# Altium schematic sheet Sheet1.SchDoc
size 420 x 297 mm; CheckedBy: Антошкин; Author: Жигалов; CompanyName: RK3AZB; DrawnBy: -; Engineer: -; DocumentNumber: -; PageSetup: Record=PageOptions|CenterHorizontal=True|CenterVertical=True|PrintScale=0.94|XCorrection=1.00|YCorrection=1.00|PrintKind=1|BorderSize=5000000|LeftOffset=0|BottomOffset=0|Orientation=1|PaperLength=1000|PaperWidth=1000|Scale=100|PaperSource=7|PrintQuality=-4|MediaType=1|DitherType=10|PaperKind=A4|PrintScaleMode=1; DecimalNumber: ---; HeadOfSector: -; MainDevice: ---; Name: Приемник Полякова; ImagePath: -
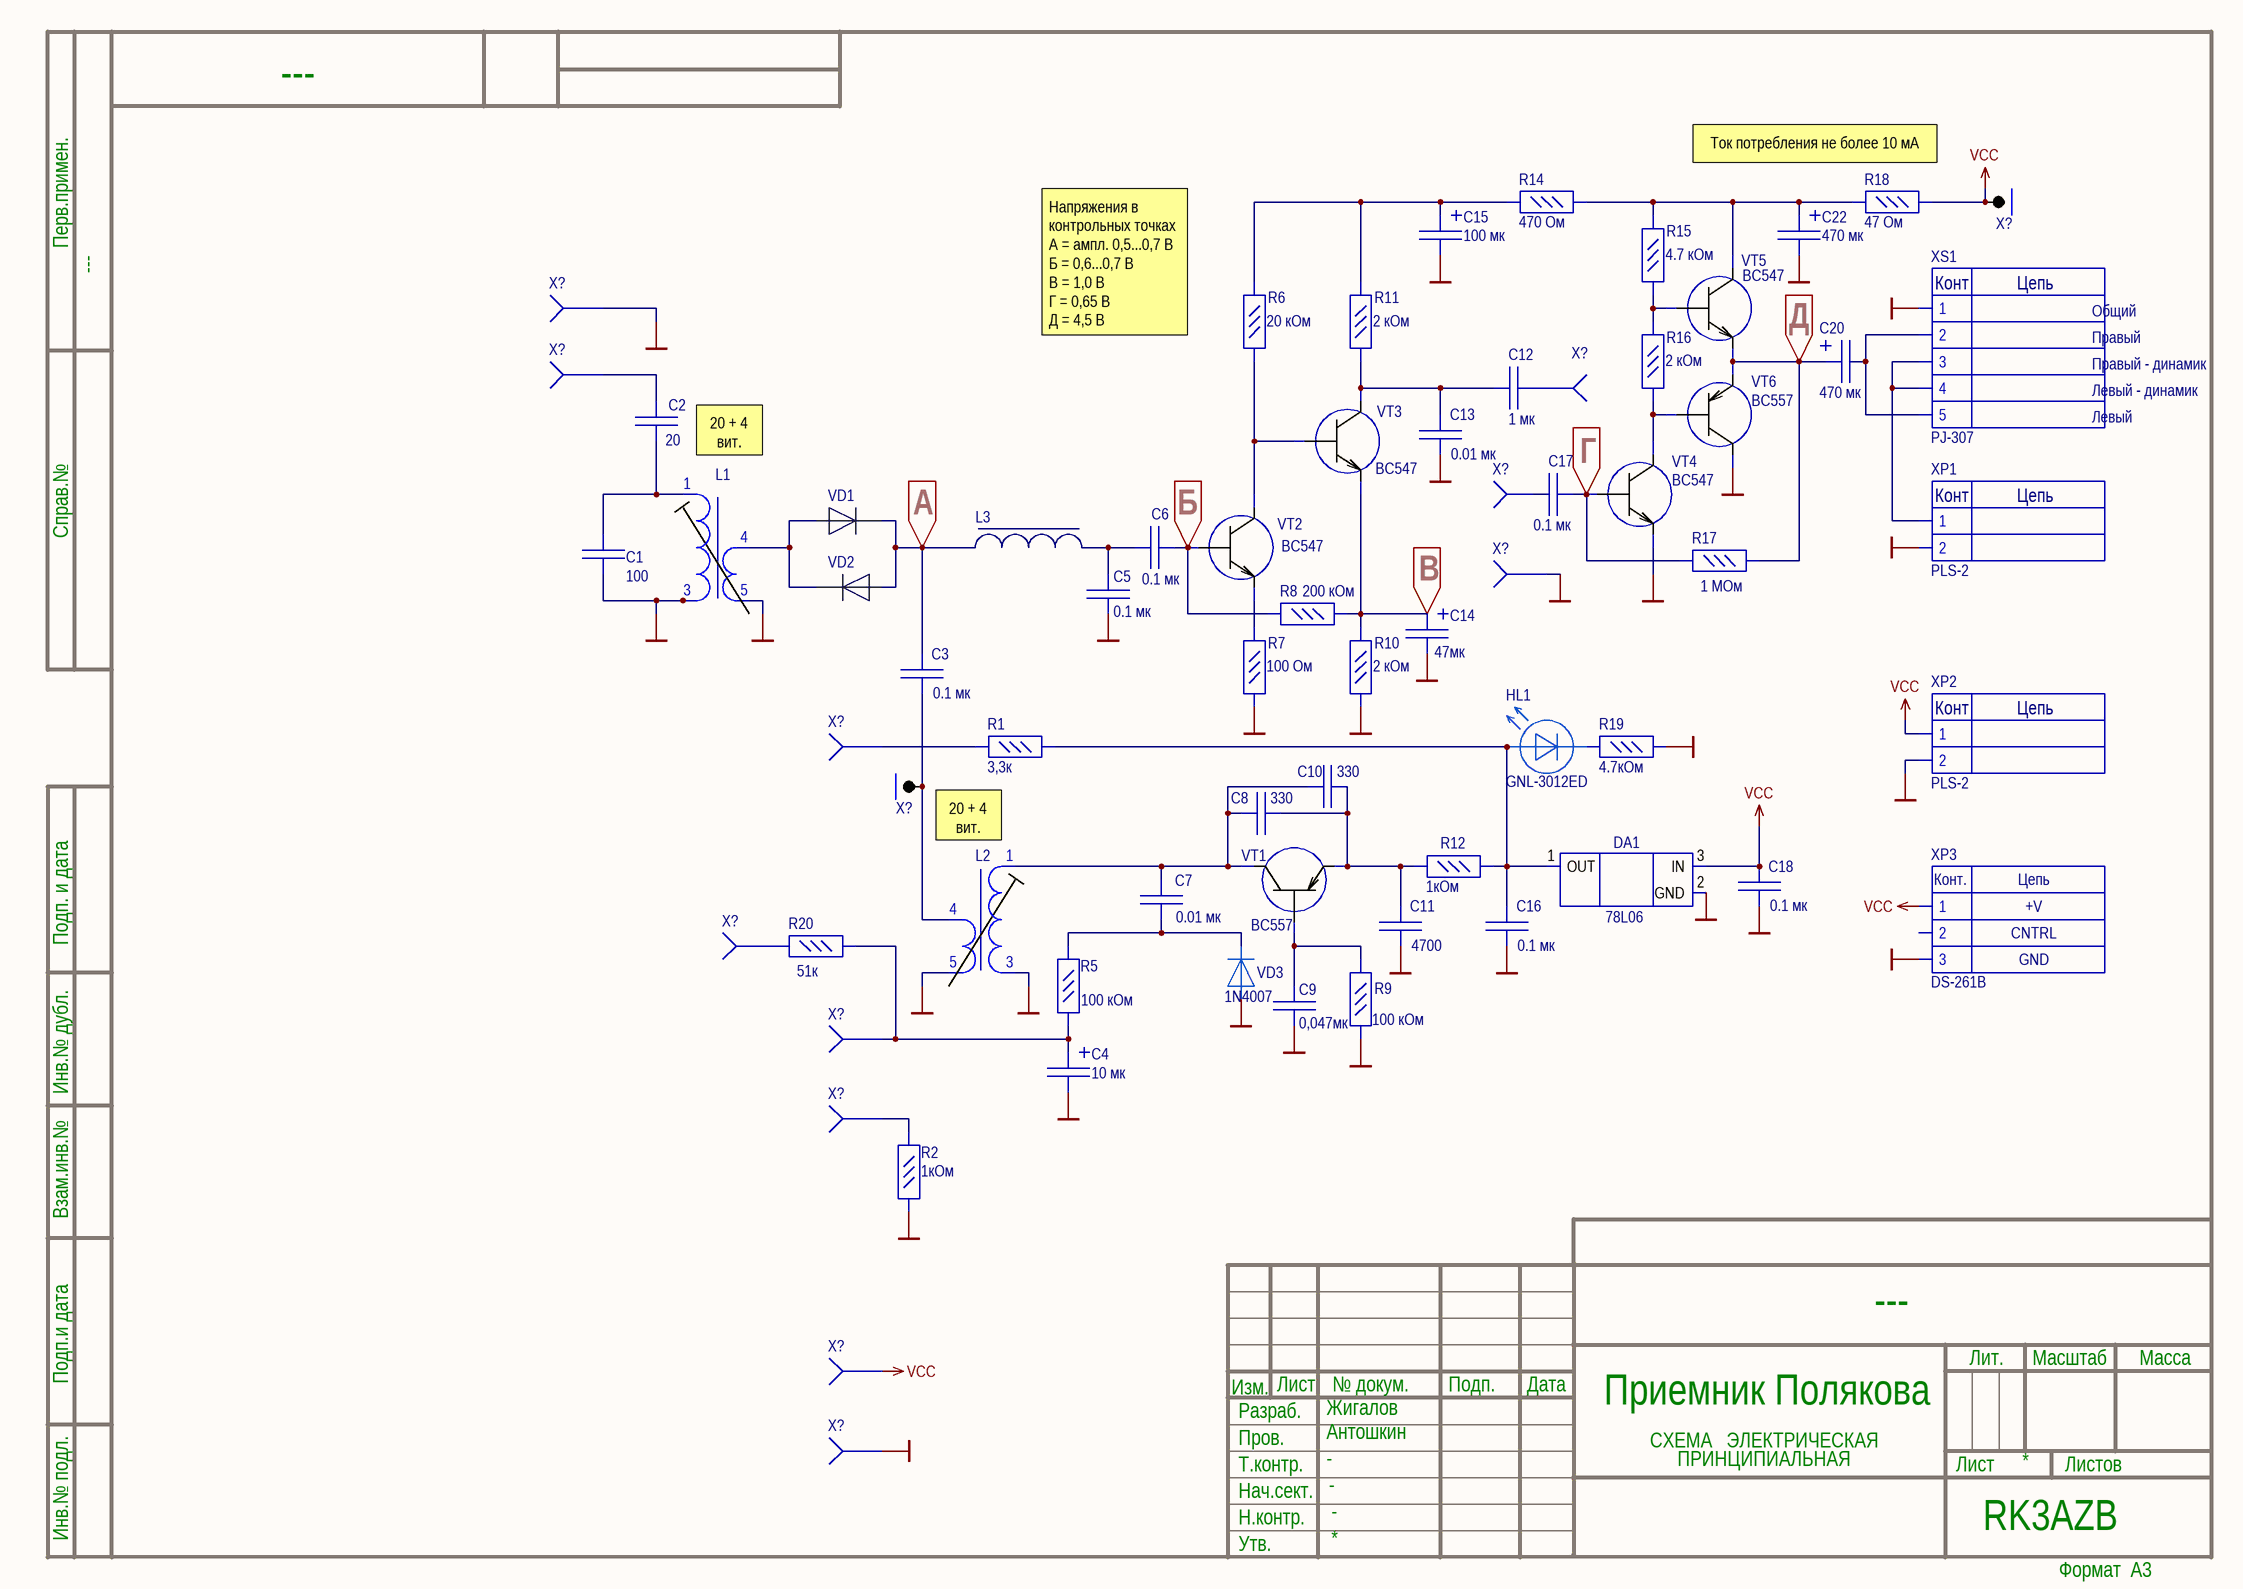
[diagram p0: Sheet1.SchDoc]

## Parts
(Parts that share a designator on the sheet are numbered #1, #2 ... from top to bottom, then left to right.)
C1  100  [К10-17Б]
C2  20  [К10-17Б]
C3  0.1 мк  [К10-17Б]
C4  10 мк  [К50-35]
C5  0.1 мк  [К10-17Б]
C6  0.1 мк  [К10-17Б]
C7  0.01 мк  [К10-17Б]
C8  330  [К10-17Б]
C9  0,047мк  [К10-17Б]
C10  330  [К10-17Б]
C11  4700  [К10-17Б]
C12  1 мк  [К10-17Б]
C13  0.01 мк  [К10-17Б]
C14  47мк  [К50-35]
C15  100 мк  [К50-35]
C16  0.1 мк  [К10-17Б]
C17  0.1 мк  [К10-17Б]
C18  0.1 мк  [К10-17Б]
C20  470 мк  [К50-35 - 8x11.5]
C22  470 мк  [К50-35 - 8x11.5]
DA1  78L06  [КТ-26]
HL1  GNL-3012ED  [GNL-3012ED]
L1  Trim_coil_2  [trim_coil]  (value not drawn)
L2  Trim_coil_2  [trim_coil]  (value not drawn)
L3  T50-6  [T50-6]  (value not drawn)
R1  3,3к  [С1-4]
R2  1кОм  [С1-4]
R5  100 кОм  [С1-4]
R6  20 кОм  [С1-4]
R7  100 Ом  [С1-4]
R8  200 кОм  [С1-4]
R9  100 кОм  [С1-4]
R10  2 кОм  [С1-4]
R11  2 кОм  [С1-4]
R12  1кОм  [С1-4]
R14  470 Ом  [С1-4]
R15  4.7 кОм  [С1-4]
R16  2 кОм  [С1-4]
R17  1 МОм  [С1-4]
R18  47 Ом  [С1-4]
R19  4.7кОм  [С1-4]
R20  51к  [С1-4]
VD1  1N4148  [DO35]  (value not drawn)
VD2  1N4148  [DO35]  (value not drawn)
VD3  1N4007  [DO-41]
VT1  BC557  [КТ-26]
VT2  BC547  [КТ-26]
VT3  BC547  [КТ-26]
VT4  BC547  [КТ-26]
VT5  BC547  [КТ-26]
VT6  BC557  [КТ-26]
X?#1  КТ  [KT]  (value not drawn)
X?#2  SMT_Contact  [SMT_CONTACT_TYPE_1]  (value not drawn)
X?#3  SMT_Contact  [SMT_CONTACT_TYPE_1]  (value not drawn)
X?#4  SMT_Contact  [SMT_CONTACT_TYPE_1]  (value not drawn)
X?#5  SMT_Contact  [SMT_CONTACT_TYPE_1]  (value not drawn)
X?#6  SMT_Contact  [SMT_CONTACT_TYPE_1]  (value not drawn)
X?#7  SMT_Contact  [SMT_CONTACT_TYPE_1]  (value not drawn)
X?#8  КТ  [KT]  (value not drawn)
X?#9  SMT_Contact  [SMT_CONTACT_TYPE_1]  (value not drawn)
X?#10  SMT_Contact  [SMT_CONTACT_TYPE_1]  (value not drawn)
X?#11  SMT_Contact  [SMT_CONTACT_TYPE_1]  (value not drawn)
X?#12  SMT_Contact  [SMT_CONTACT_TYPE_1]  (value not drawn)
X?#13  SMT_Contact  [SMT_CONTACT_TYPE_1]  (value not drawn)
XP1  PLS-2  [PLS-2]
XP2  PLS-2  [PLS-2]
XP3  DS-261B  [DS-261]
XS1  PJ-307  [PJ-307]

## Nets
GND: C1.1 C4.2 C5.1 C9.1 C11.1 C13.1 C14.2 C15.2 C16.1 C18.1 C22.2 DA1.2(GND) L1.3 L1.5 L2.3 L2.5 R2.1 R7.1 R9.1 R10.1 R19.1 VD3.1 VT4.3(E) VT6.1(C) X?#2.1 X?#6.1 X?#13.1 XP1.2 XP2.2 XP3.3 XS1.1
VCC: C18.2 DA1.3(IN) R18.1 X?#1.1 X?#12.1 XP2.1 XP3.1
NetC1_2: C1.2 C2.1 L1.1
NetC2_2: C2.2 X?#3.1
NetC3_1: C3.1 L2.4 X?#8.1
NetC3_2: C3.2 L3.1 VD1.2 VD2.1
NetC4_1: C4.1 R5.1 R20.1 X?#10.1
NetC5_2: C5.2 C6.2 L3.2
NetC6_1: C6.1 R8.2 VT2.2(B)
NetC7_1: C7.1 C8.2 C10.2 L2.1 VT1.1(C)
NetC7_2: C7.2 R5.2 VD3.2
NetC8_1: C8.1 C10.1 C11.2 R12.1 VT1.3(E)
NetC9_2: C9.2 R9.2 VT1.2(B)
NetC12_1: C12.1 X?#4.1
NetC12_2: C12.2 C13.2 R11.1 VT3.1(C)
NetC14_1: C14.1 R8.1 R10.2 VT3.3(E)
NetC15_1: C15.1 R6.2 R11.2 R14.2
NetC16_2: C16.2 DA1.1(OUT) HL1.1 R1.1 R12.2
NetC17_1: C17.1 R17.2 VT4.2(B)
NetC17_2: C17.2 X?#5.1
NetC20_1: C20.1 R17.1 VT5.3(E) VT6.3(E)
NetC20_2: C20.2 XS1.2 XS1.5
NetC22_1: C22.1 R14.1 R15.2 R18.2 VT5.1(C)
NetHL1_2: HL1.2 R19.2
NetL1_4: L1.4 VD1.1 VD2.2
NetR1_2: R1.2 X?#7.1
NetR2_2: R2.2 X?#11.1
NetR6_1: R6.1 VT2.1(C) VT3.2(B)
NetR7_2: R7.2 VT2.3(E)
NetR15_1: R15.1 R16.2 VT5.2(B)
NetR16_1: R16.1 VT4.1(C) VT6.2(B)
NetR20_2: R20.2 X?#9.1
NetXP1_1: XP1.1 XS1.3 XS1.4

Not connected (* = marked no-connect by the designer): XP3 2

## Notes on the sheet
- (near R18) Ток потребления не более 10 мА
- Напряжения в контрольных точках
  А = ампл. 0,5...0,7 В
  Б = 0,6...0,7 В
  В = 1,0 В
  Г = 0,65 В
  Д = 4,5 В
- Д
- 20 + 4 вит.
  ф 0.8
- A
- (near VT2) Б
- (near VT4) Г
- (near C14) В
- Перв.примен.
- Справ.№
- Подп. и дата
- Инв.№ дубл.
- Взам.инв.№
- Подп.и дата
- Разраб.
- Изм.
- Лист
- № докум.
- Подп.
- Дата
- Лит.
- Масштаб
- Масса
- Т.контр.
- Пров.
- СХЕМА   ЭЛЕКТРИЧЕСКАЯ
- ПРИНЦИПИАЛЬНАЯ
- Листов
- Инв.№ подл.
- Утв.
- Н.контр.
- Нач.сект.
- Формат  A3
- (in symbol DS-261B) Конт.; Цепь; +V; CNTRL; GND
- (in symbol PJ-307) Конт; Цепь; Общий; Правый; Правый - динамик; Левый - динамик; Левый
- (in symbol PLS-2) Конт; Цепь

## Library data of the parts
C1-C3 C5-C13 C16-C18 = C_К10-17Б
C4 C14 C15 C20 C22 = K50-35
R1 R2 R5-R12 R14-R20 = R_C1-4
VD1 VD2 = 1N4148: Диод
VD3 = 1N4007: Диод